# Altium schematic sheet LIDO-HW.200.MCU_Peripherals_1.SchDoc
size A3; SheetNumber: 10; SheetTotal: 17
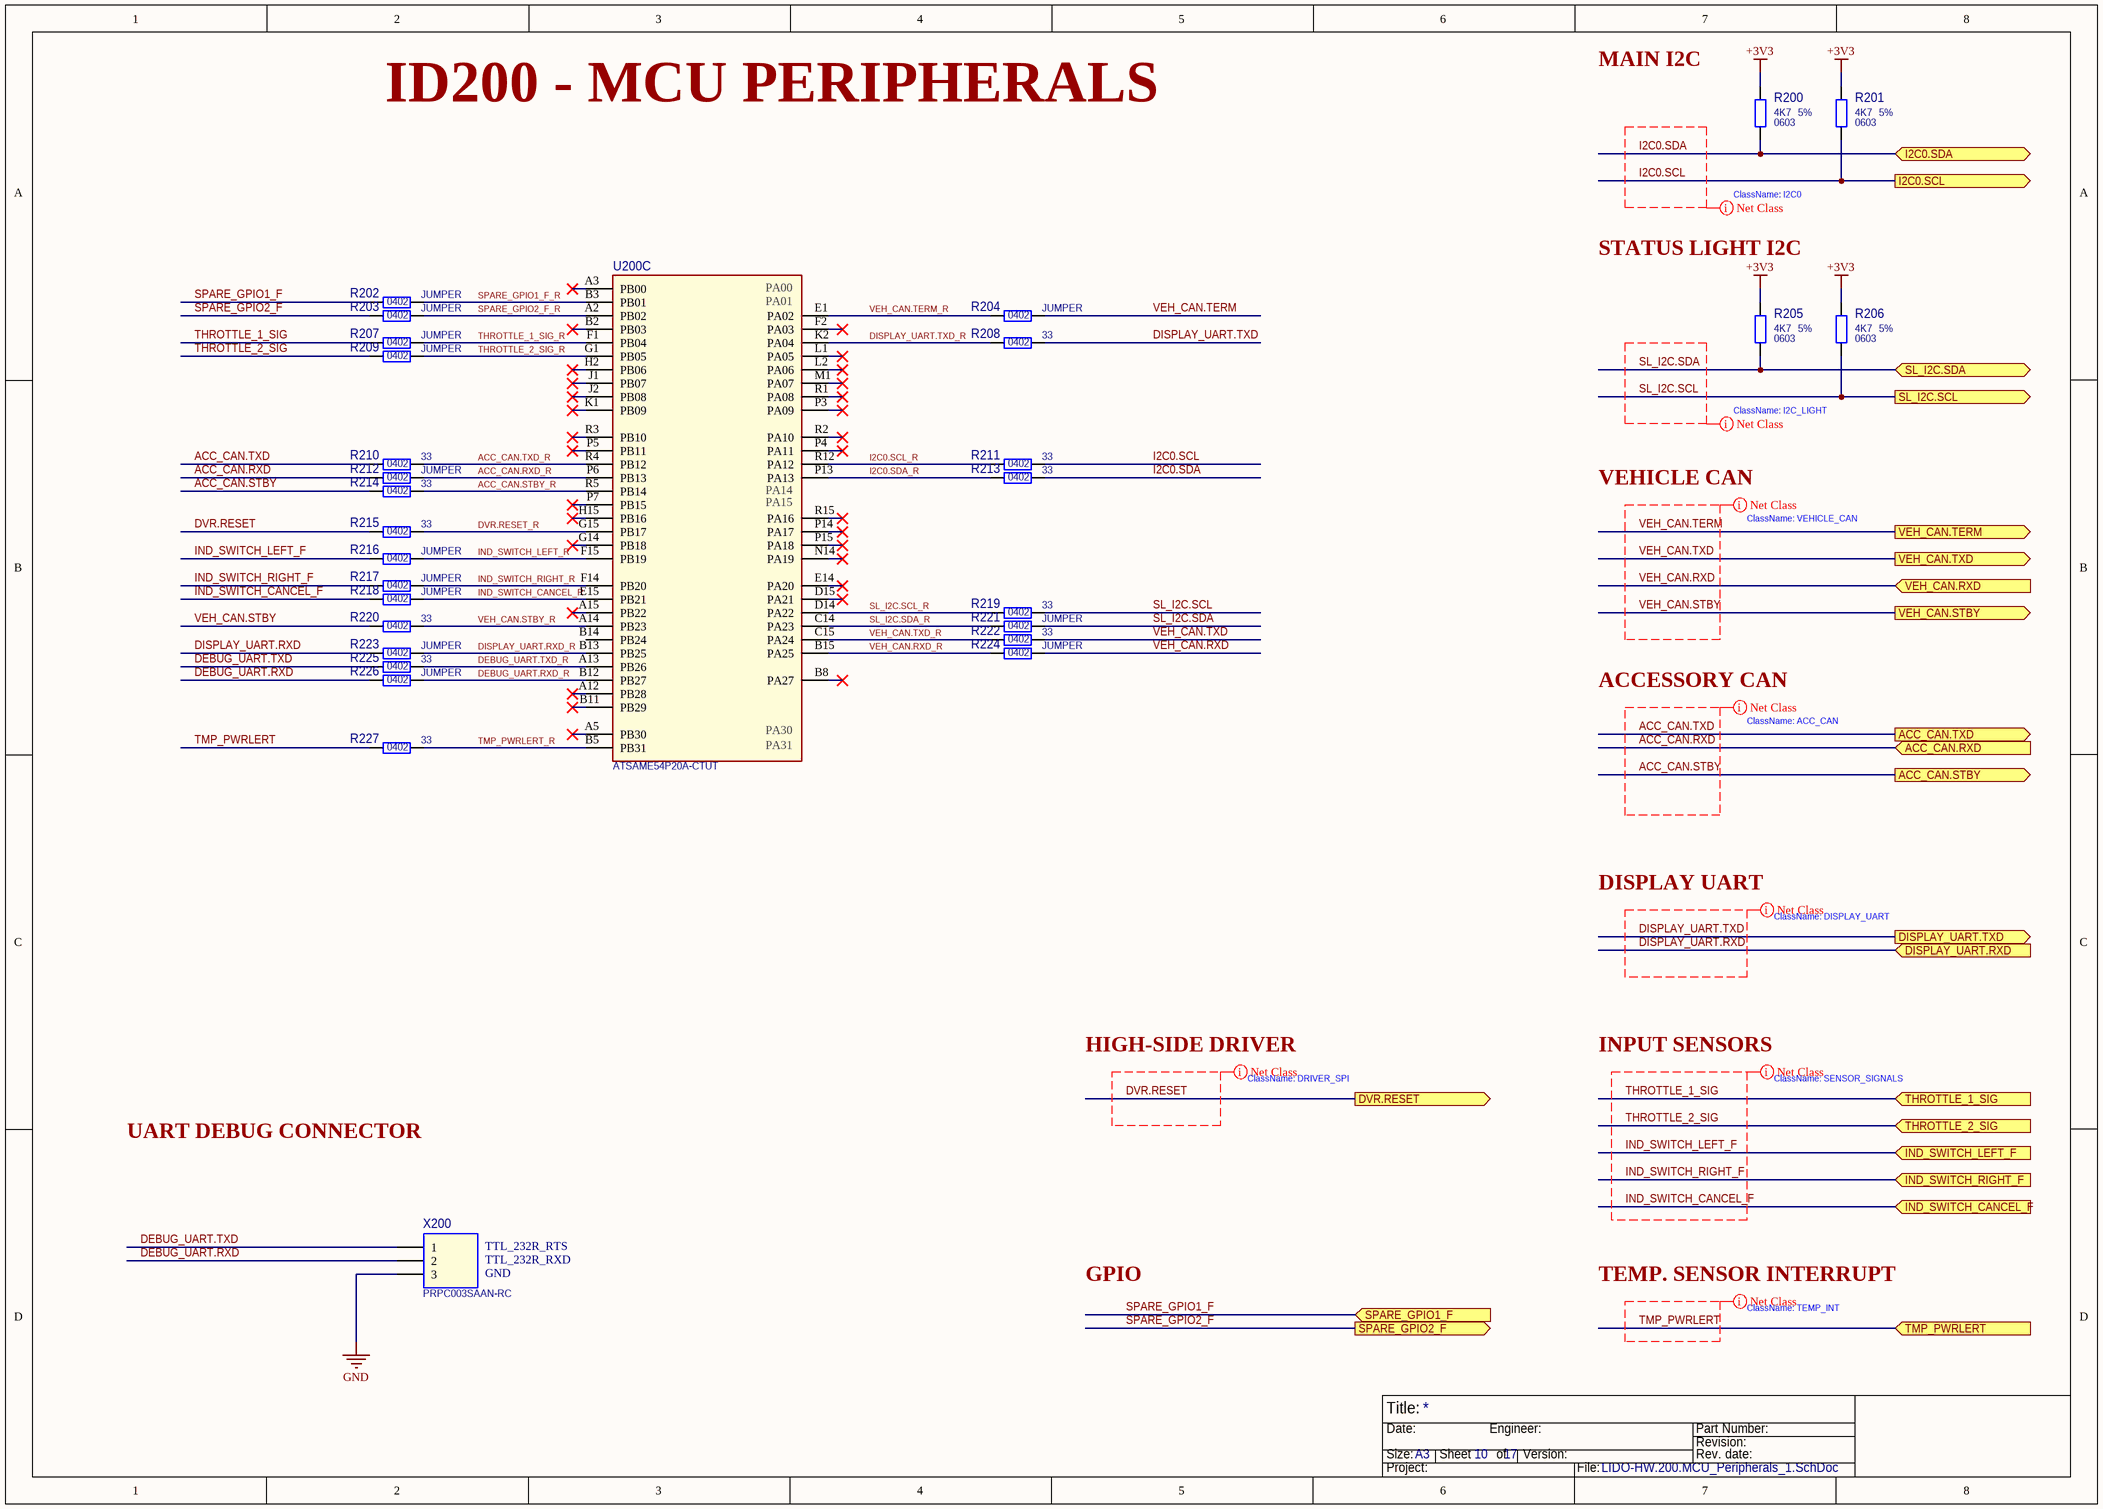
[diagram p0: LIDO-HW.200.MCU_Peripherals_1.SchDoc]

## Parts
R200  4K7  Part Value 2: 5%  Part Package: 0603  [RES_0603_1608X60-N_YAGEO_A]
R201  4K7  Part Value 2: 5%  Part Package: 0603  [RES_0603_1608X60-N_YAGEO_A]
R202  JUMPER  Part Package: 0402  [RES_0402_1005X40-N_YAGEO_A]
R203  JUMPER  Part Package: 0402  [RES_0402_1005X40-N_YAGEO_A]
R204  JUMPER  Part Package: 0402  [RES_0402_1005X40-N_YAGEO_A]
R205  4K7  Part Value 2: 5%  Part Package: 0603  [RES_0603_1608X60-N_YAGEO_A]
R206  4K7  Part Value 2: 5%  Part Package: 0603  [RES_0603_1608X60-N_YAGEO_A]
R207  JUMPER  Part Package: 0402  [RES_0402_1005X40-N_YAGEO_A]
R208  33  Part Package: 0402  [RES_0402_1005X40-N_YAGEO_A]
R209  JUMPER  Part Package: 0402  [RES_0402_1005X40-N_YAGEO_A]
R210  33  Part Package: 0402  [RES_0402_1005X40-N_YAGEO_A]
R211  33  Part Package: 0402  [RES_0402_1005X40-N_YAGEO_A]
R212  JUMPER  Part Package: 0402  [RES_0402_1005X40-N_YAGEO_A]
R213  33  Part Package: 0402  [RES_0402_1005X40-N_YAGEO_A]
R214  33  Part Package: 0402  [RES_0402_1005X40-N_YAGEO_A]
R215  33  Part Package: 0402  [RES_0402_1005X40-N_YAGEO_A]
R216  JUMPER  Part Package: 0402  [RES_0402_1005X40-N_YAGEO_A]
R217  JUMPER  Part Package: 0402  [RES_0402_1005X40-N_YAGEO_A]
R218  JUMPER  Part Package: 0402  [RES_0402_1005X40-N_YAGEO_A]
R219  33  Part Package: 0402  [RES_0402_1005X40-N_YAGEO_A]
R220  33  Part Package: 0402  [RES_0402_1005X40-N_YAGEO_A]
R221  JUMPER  Part Package: 0402  [RES_0402_1005X40-N_YAGEO_A]
R222  33  Part Package: 0402  [RES_0402_1005X40-N_YAGEO_A]
R223  JUMPER  Part Package: 0402  [RES_0402_1005X40-N_YAGEO_A]
R224  JUMPER  Part Package: 0402  [RES_0402_1005X40-N_YAGEO_A]
R225  33  Part Package: 0402  [RES_0402_1005X40-N_YAGEO_A]
R226  JUMPER  Part Package: 0402  [RES_0402_1005X40-N_YAGEO_A]
R227  33  Part Package: 0402  [RES_0402_1005X40-N_YAGEO_A]
U200  ATSAME54P20A-CTUT  [BGA120CP50_15X15_800X800X120B25-N_MICROCHIP_A]  (part C of 4)
X200  PRPC003SAAN-RC  [HDR_3POS_1X3-N_WURTH_A]

## Ports
ACC_CAN.RXD (in), ACC_CAN.STBY (out), ACC_CAN.TXD (out), DISPLAY_UART.RXD (in), DISPLAY_UART.TXD (out), DVR.RESET (out), I2C0.SCL (out), I2C0.SDA (bidir), IND_SWITCH_CANCEL_F (in), IND_SWITCH_LEFT_F (in), IND_SWITCH_RIGHT_F (in), SL_I2C.SCL (out), SL_I2C.SDA (bidir), SPARE_GPIO1_F (in), SPARE_GPIO2_F (out), THROTTLE_1_SIG (in), THROTTLE_2_SIG (in), TMP_PWRLERT (in), VEH_CAN.RXD (in), VEH_CAN.STBY (out), VEH_CAN.TERM (out), VEH_CAN.TXD (out)

## Nets
+3V3: R200.2 R201.2 R205.2 R206.2
GND: X200.3
ACC_CAN.RXD: R212.1 ; port ACC_CAN.RXD
ACC_CAN.RXD_R: R212.2 U200.P6(PB13)
ACC_CAN.STBY: R214.1 ; port ACC_CAN.STBY
ACC_CAN.STBY_R: R214.2 U200.R5(PB14)
ACC_CAN.TXD: R210.1 ; port ACC_CAN.TXD
ACC_CAN.TXD_R: R210.2 U200.R4(PB12)
DEBUG_UART.RXD: R226.1 X200.2
DEBUG_UART.RXD_R: R226.2 U200.B12(PB27)
DEBUG_UART.TXD: R225.1 X200.1
DEBUG_UART.TXD_R: R225.2 U200.A13(PB26)
DISPLAY_UART.RXD: R223.1 ; port DISPLAY_UART.RXD
DISPLAY_UART.RXD_R: R223.2 U200.B13(PB25)
DISPLAY_UART.TXD: R208.2 ; port DISPLAY_UART.TXD
DISPLAY_UART.TXD_R: R208.1 U200.K2(PA04)
DVR.RESET: R215.1 ; port DVR.RESET
DVR.RESET_R: R215.2 U200.G15(PB17)
I2C0.SCL: R201.1 R211.2 ; port I2C0.SCL
I2C0.SCL_R: R211.1 U200.R12(PA12)
I2C0.SDA: R200.1 R213.2 ; port I2C0.SDA
I2C0.SDA_R: R213.1 U200.P13(PA13)
IND_SWITCH_CANCEL_F: R218.1 ; port IND_SWITCH_CANCEL_F
IND_SWITCH_CANCEL_R: R218.2 U200.E15(PB21)
IND_SWITCH_LEFT_F: R216.1 ; port IND_SWITCH_LEFT_F
IND_SWITCH_LEFT_R: R216.2 U200.F15(PB19)
IND_SWITCH_RIGHT_F: R217.1 ; port IND_SWITCH_RIGHT_F
IND_SWITCH_RIGHT_R: R217.2 U200.F14(PB20)
SL_I2C.SCL: R206.1 R219.2 ; port SL_I2C.SCL
SL_I2C.SCL_R: R219.1 U200.D14(PA22)
SL_I2C.SDA: R205.1 R221.2 ; port SL_I2C.SDA
SL_I2C.SDA_R: R221.1 U200.C14(PA23)
SPARE_GPIO1_F: R202.1 ; port SPARE_GPIO1_F
SPARE_GPIO1_F_R: R202.2 U200.B3(PB01)
SPARE_GPIO2_F: R203.1 ; port SPARE_GPIO2_F
SPARE_GPIO2_F_R: R203.2 U200.A2(PB02)
THROTTLE_1_SIG: R207.1 ; port THROTTLE_1_SIG
THROTTLE_1_SIG_R: R207.2 U200.F1(PB04)
THROTTLE_2_SIG: R209.1 ; port THROTTLE_2_SIG
THROTTLE_2_SIG_R: R209.2 U200.G1(PB05)
TMP_PWRLERT: R227.1 ; port TMP_PWRLERT
TMP_PWRLERT_R: R227.2 U200.B5(PB31)
VEH_CAN.RXD: R224.2 ; port VEH_CAN.RXD
VEH_CAN.RXD_R: R224.1 U200.B15(PA25)
VEH_CAN.STBY: R220.1 ; port VEH_CAN.STBY
VEH_CAN.STBY_R: R220.2 U200.A14(PB23)
VEH_CAN.TERM: R204.2 ; port VEH_CAN.TERM
VEH_CAN.TERM_R: R204.1 U200.E1(PA02)
VEH_CAN.TXD: R222.2 ; port VEH_CAN.TXD
VEH_CAN.TXD_R: R222.1 U200.C15(PA24)

Not connected (* = marked no-connect by the designer): U200 A3(PB00)* A5(PB30)* A12(PB28)* A15(PB22)* B2(PB03)* B8(PA27)* B11(PB29)* B14(PB24) D15(PA21)* E14(PA20)* F2(PA03)* G14(PB18)* H2(PB06)* H15(PB16)* J1(PB07)* J2(PB08)* K1(PB09)* L1(PA05)* L2(PA06)* M1(PA07)* N14(PA19)* P3(PA09)* P4(PA11)* P5(PB11)* P7(PB15)* P14(PA17)* P15(PA18)* R1(PA08)* R2(PA10)* R3(PB10)* R15(PA16)*

## Layout directives
net class I2C0: I2C0.SCL, I2C0.SDA
net class VEHICLE_CAN: VEH_CAN.RXD, VEH_CAN.STBY, VEH_CAN.TERM, VEH_CAN.TXD
net class ACC_CAN: ACC_CAN.RXD, ACC_CAN.STBY, ACC_CAN.TXD
net class I2C1_LIGHT: SL_I2C.SCL, SL_I2C.SDA
net class TEMP_INT: TMP_PWRLERT
net class DISPLAY_UART: DISPLAY_UART.RXD, DISPLAY_UART.TXD
net class DRIVER_SPI: DVR.RESET
net class SENSOR_SIGNALS: IND_SWITCH_CANCEL_F, IND_SWITCH_LEFT_F, IND_SWITCH_RIGHT_F, THROTTLE_1_SIG, THROTTLE_2_SIG

## Notes on the sheet
- ID200 - MCU PERIPHERALS
- MAIN I2C
- ClassName: I2C0
- STATUS LIGHT I2C
- ClassName: I2C_LIGHT
- VEHICLE CAN
- ClassName: VEHICLE_CAN
- ACCESSORY CAN
- ClassName: ACC_CAN
- DISPLAY UART
- ClassName: DISPLAY_UART
- HIGH-SIDE DRIVER
- INPUT SENSORS
- ClassName: DRIVER_SPI
- ClassName: SENSOR_SIGNALS
- UART DEBUG CONNECTOR
- TTL_232R_RXD
- TTL_232R_RTS
- GND
- GPIO
- TEMP. SENSOR INTERRUPT
- ClassName: TEMP_INT
- Title:
- Size:
- Date:
- A3
- Sheet       of
- Engineer:
- Version:
- Part Number:
- Revision:
- Rev. date:
- Project:
- File:
- (in symbol 10, part C) PA00; PA01; PA14; PA15; PA30; PA31

## Library data of the parts
R200 R201 R205 R206 = 119: RES 4.7K OHM 5% 1/10W 0603; Manufacturer Part Number: RC0603JR-074K7L; Manufacturer: YAGEO; Obsolete Part: False; Component ID: 119; Part Value: 4K7; Part Value 3: 1/10W; Package Type: SMT
R202-R204 R207 R209 R212 R216-R218 R221 R223 R224 R226 = 127: RES SMD 0 OHM JUMPER 1/10W 0402; Manufacturer Part Number: ERJ-2GE0R00X; Manufacturer: Panasonic Electronic Components; Obsolete Part: False; Component ID: 127; Part Value: JUMPER; Part Value 3: 1/10W; Package Type: SMT
R208 R210 R211 R213-R215 R219 R220 R222 R225 R227 = 111: RES SMD 33 OHM 5% 1/10W 0402; Manufacturer Part Number: ERJ-2GEJ330X; Manufacturer: Panasonic Electronic Components; Obsolete Part: False; Component ID: 111; Part Value: 33; Part Value 2: 5%; Part Value 3: 1/10W; Package Type: SMT
U200 = 10: ARM® Cortex®-M4F series Microcontroller IC 32-Bit Single-Core 120MHz 1MB (1M x 8) FLASH 120-TFBGA (8x8); Manufacturer: Microchip Technology; Part Package: TFBGA-120; Obsolete Part: False; Component ID: 10; Manufacturer Part Number: ATSAME54P20A-CTUT; Part Type: MCU M4; Package Type: SMT
X200 = 53: CONN HEADER VERT 3POS 2.54MM; Manufacturer: Sullins Connector Solutions; Part Value: 3-Pins; Obsolete Part: False; Component ID: 53; Manufacturer Part Number: PRPC003SAAN-RC; Part Pitch: 2.54mm